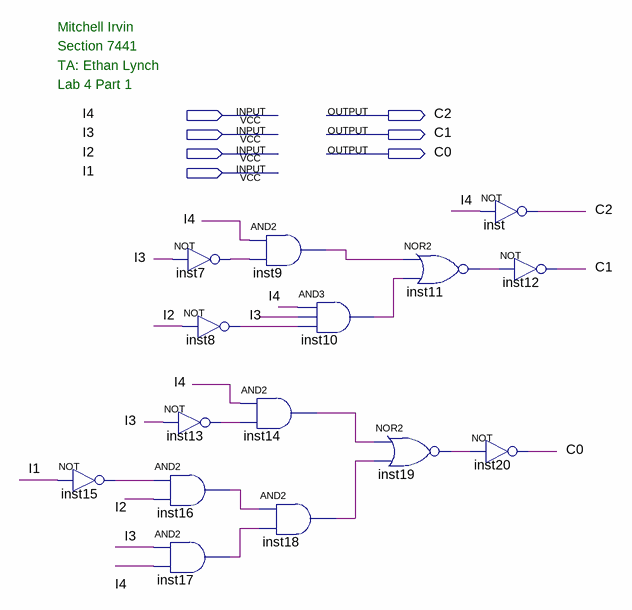
[diagram p0: schematic sheet]
// Quartus schematic lab4part1.bdf as structural Verilog: 15 symbols, 7 pins
module lab4part1 (
  input  I4,
  input  I3,
  input  I2,
  input  I1,
  output C2,
  output C1,
  output C0
);

  wire inst7_out, inst8_out, inst9_out, inst10_out, inst11_out, inst13_out, inst14_out, inst15_out,
       inst16_out, inst17_out, inst18_out, inst19_out;

  not inst15 (inst15_out, I1);
  and inst16 (inst16_out, inst15_out, I2);
  and inst17 (inst17_out, I3, I4);
  not inst7 (inst7_out, I3);
  not inst8 (inst8_out, I2);
  not inst13 (inst13_out, I3);
  and inst9 (inst9_out, I4, inst7_out);
  and inst10 (inst10_out, I4, I3, inst8_out);
  and inst14 (inst14_out, I4, inst13_out);
  and inst18 (inst18_out, inst16_out, inst17_out);
  nor inst19 (inst19_out, inst14_out, inst18_out);
  nor inst11 (inst11_out, inst9_out, inst10_out);
  not inst (C2, I4);
  not inst12 (C1, inst11_out);
  not inst20 (C0, inst19_out);

  // Notes on the sheet:
  //   Mitchell Irvin
  //   Section 7441
  //   TA: Ethan Lynch
  //   Lab 4 Part 1
endmodule
